# EAGLE schematic Saules kolektoriaus valdiklis v1.22 (EAGLE 6.5.0)
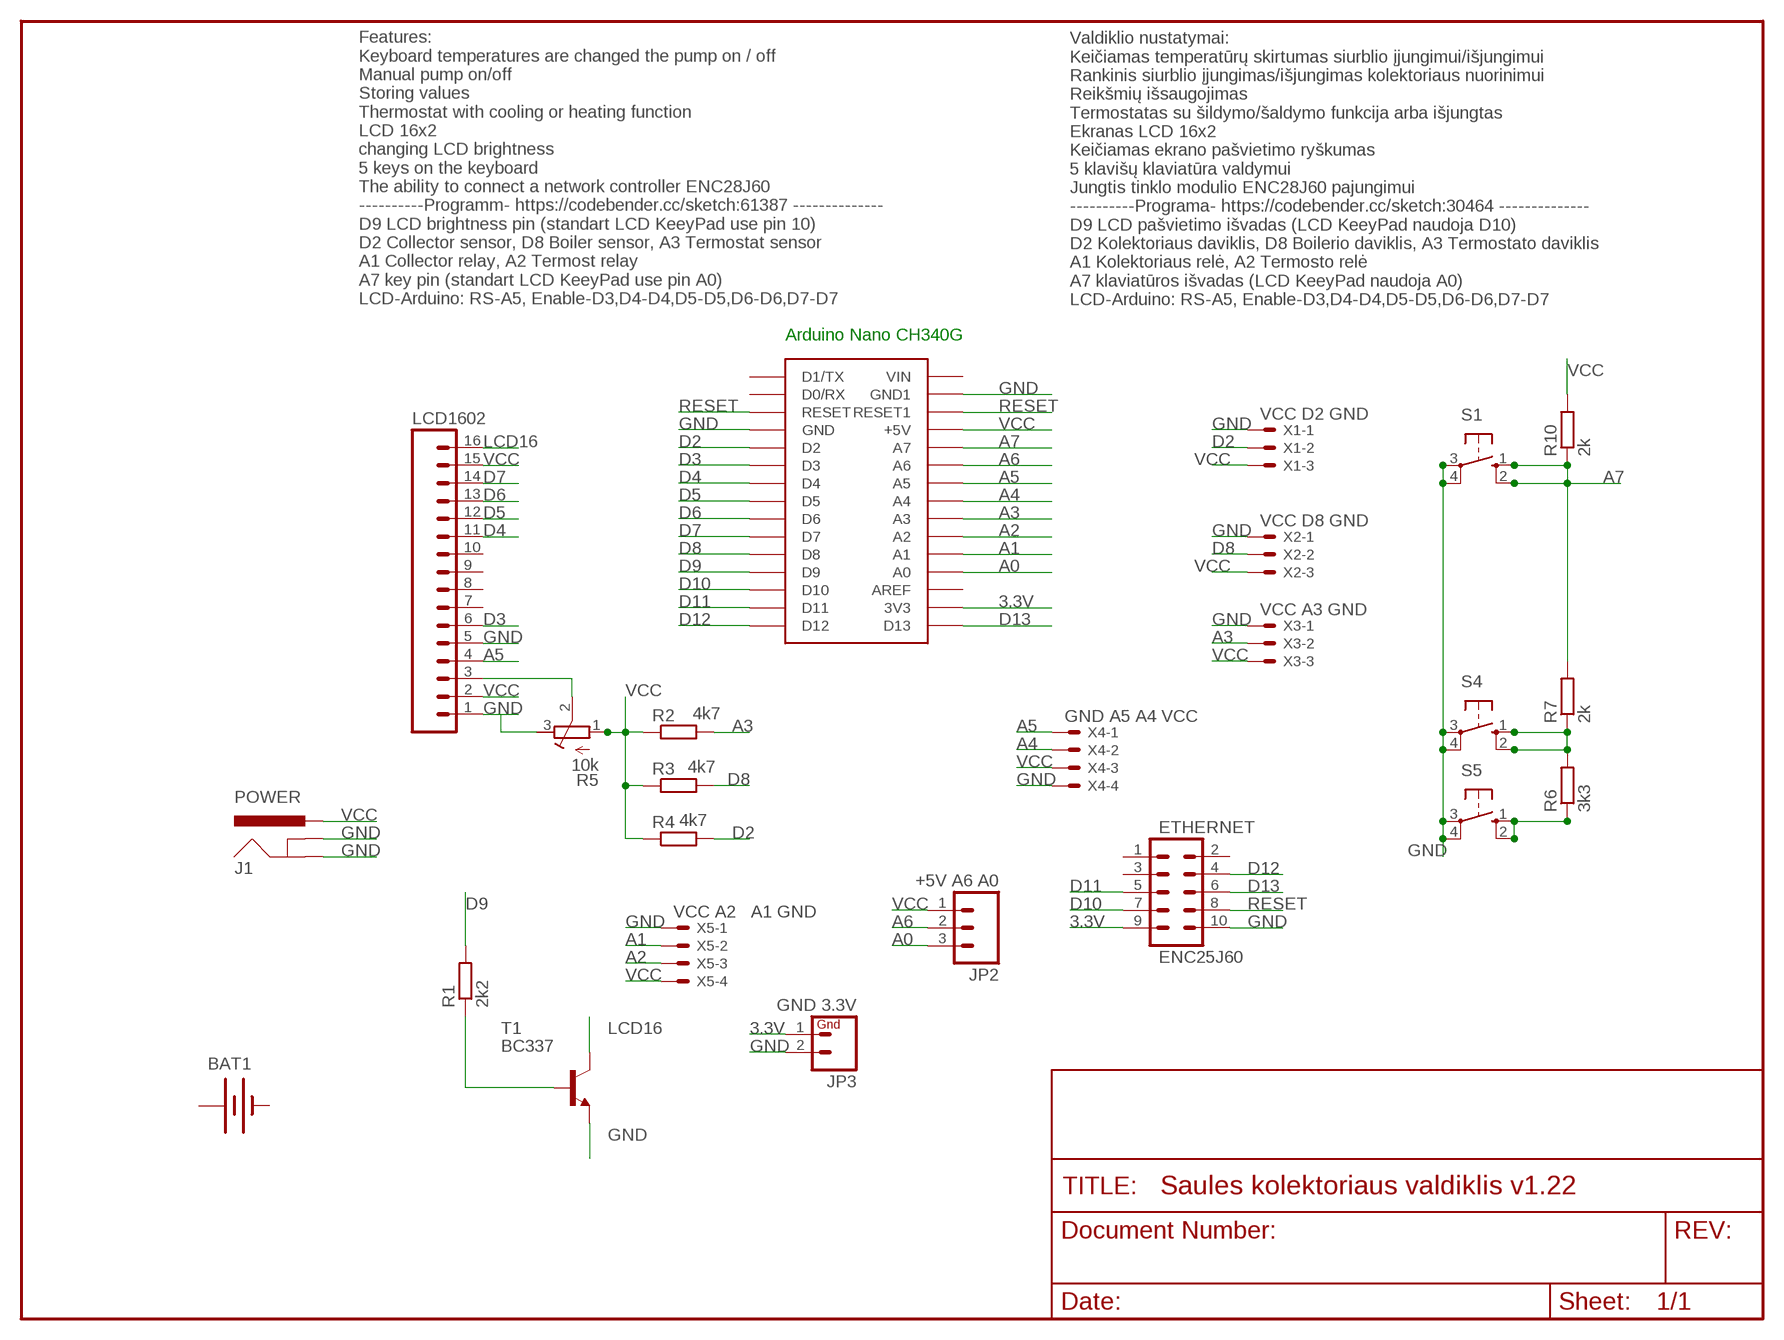
[diagram p0: schematic, sheet 1]

## Parts
ARDUINONANOCH340G  ARDUINONANO  [PDIP-32]
BAT1  BATTERY20PTH  [BATTCOM_20MM_PTH]
ETHERNET  ENC25J60  M05X2PTH  [AVR_ICSP]
J1  POWER  POWER_JACKPTH_LOCK  [POWER_JACK_PTH_LOCK]
JP2  +5V A6 A0  M03PTH  [1X03]
JP3  GND 3.3V  M02PTH  [1X02]
LCD1602  HEADER-16P-2.54  [16P-2.54]
R1  2k2  R-EU_0207/10  [0207/10]
R2  4k7  R-EU_0207/10  [0207/10]
R3  4k7  R-EU_0207/10  [0207/10]
R4  4k7  R-EU_0207/10  [0207/10]
R5  10k  R-TRIMM64W  [RTRIM64W]
R6  3k3  R-EU_0207/10  [0207/10]
R7  2k  R-EU_0207/10  [0207/10]
R10  2k  R-EU_0207/10  [0207/10]
S1  10-XX  [B3F-10XX]
S4  10-XX  [B3F-10XX]
S5  10-XX  [B3F-10XX]
T1  BC337  [TO92]
X1  VCC D2 GND  22-23-2031  [22-23-2031]
X2  VCC D8 GND  22-23-2031  [22-23-2031]
X3  VCC A3 GND  22-23-2031  [22-23-2031]
X4  GND A5 A4 VCC  22-23-2041  [22-23-2041]
X5  VCC A2 A1 GND  22-23-2041  [22-23-2041]

## Nets
3.3V: ARDUINONANOCH340G.3V3 ETHERNET.9 JP3.1
A0: ARDUINONANOCH340G.A0 JP2.3
A1: ARDUINONANOCH340G.A1 X5.2
A2: ARDUINONANOCH340G.A2 X5.3
A3: ARDUINONANOCH340G.A3 R2.2 X3.2
A4: ARDUINONANOCH340G.A4 X4.2
A5: ARDUINONANOCH340G.A5 LCD1602.4 X4.1
A6: ARDUINONANOCH340G.A6 JP2.2
A7: ARDUINONANOCH340G.A7 R7.2 R10.1 S1.1(S) S1.2(S1)
D2: ARDUINONANOCH340G.D2 R4.2 X1.2
D3: ARDUINONANOCH340G.D3 LCD1602.6
D4: ARDUINONANOCH340G.D4 LCD1602.11
D5: ARDUINONANOCH340G.D5 LCD1602.12
D6: ARDUINONANOCH340G.D6 LCD1602.13
D7: ARDUINONANOCH340G.D7 LCD1602.14
D8: ARDUINONANOCH340G.D8 R3.2 X2.2
D9: ARDUINONANOCH340G.D9 R1.2
D10: ARDUINONANOCH340G.D10 ETHERNET.7
D11: ARDUINONANOCH340G.D11 ETHERNET.5
D12: ARDUINONANOCH340G.D12 ETHERNET.4
D13: ARDUINONANOCH340G.D13 ETHERNET.6
GND [vcc]: ARDUINONANOCH340G.GND ARDUINONANOCH340G.GND1 ETHERNET.10 J1.GND J1.GNDBREAK JP3.2 LCD1602.1 LCD1602.5 R5.3(A) S1.3(P) S1.4(P1) S4.3(P) S4.4(P1) S5.3(P) S5.4(P1) T1.1(E) X1.1 X2.1 X3.1 X4.4 X5.1
LCD16: LCD1602.16 T1.3(C)
N$1: LCD1602.3 R5.2(S)
N$4: R1.1 T1.2(B)
N$5: R6.1 S5.1(S) S5.2(S1)
N$6: R6.2 R7.1 S4.1(S) S4.2(S1)
RESET: ARDUINONANOCH340G.RESET ARDUINONANOCH340G.RESET1 ETHERNET.8
VCC: ARDUINONANOCH340G.+5V J1.PWR JP2.1 LCD1602.2 LCD1602.15 R2.1 R3.1 R4.1 R5.1(E) R10.2 X1.3 X2.3 X3.3 X4.3 X5.4
Unconnected: ARDUINONANOCH340G.AREF ARDUINONANOCH340G.D0/RX ARDUINONANOCH340G.D1/TX ARDUINONANOCH340G.VIN ETHERNET.1 ETHERNET.2 ETHERNET.3 LCD1602.7 LCD1602.8 LCD1602.9 LCD1602.10

## Notes on the sheet
- Valdiklio nustatymai:
  Keičiamas temperatūrų skirtumas siurblio įjungimui/išjungimui
  Rankinis siurblio įjungimas/išjungimas kolektoriaus nuorinimui
  Reikšmių išsaugojimas
  Termostatas su šildymo/šaldymo funkcija arba išjungtas
  Ekranas LCD 16x2
  Keičiamas ekrano pašvietimo ryškumas
  5 klavišų klaviatūra valdymui
  Jungtis tinklo modulio ENC28J60 pajungimui
  ----------Programa- https://codebender.cc/sketch:30464 --------------
  D9 LCD pašvietimo išvadas (LCD KeeyPad naudoja D10)
  D2 Kolektoriaus daviklis, D8 Boilerio daviklis, A3 Termostato daviklis
  A1 Kolektoriaus relė, A2 Termosto relė
  A7 klaviatūros išvadas (LCD KeeyPad naudoja A0)
  LCD-Arduino: RS-A5, Enable-D3,D4-D4,D5-D5,D6-D6,D7-D7
- Features:
  Keyboard temperatures are changed the pump on / off
  Manual pump on/off
  Storing values
  Thermostat with cooling or heating function
  LCD 16x2
  changing LCD brightness
  5 keys on the keyboard
  The ability to connect a network controller ENC28J60
  ----------Programm- https://codebender.cc/sketch:61387 --------------
  D9 LCD brightness pin (standart LCD KeeyPad use pin 10)
  D2 Collector sensor, D8 Boiler sensor, A3 Termostat sensor
  A1 Collector relay, A2 Termost relay
  A7 key pin (standart LCD KeeyPad use pin A0)
  LCD-Arduino: RS-A5, Enable-D3,D4-D4,D5-D5,D6-D6,D7-D7
- Arduino Nano CH340G

## Power pins joined to a net without a drawn wire
+: BAT1.1(+)
-: BAT1.2(-)

## Library data of the parts
ARDUINONANOCH340G = rocketfarm:ARDUINONANO
BAT1 = SparkFun-Electromechanical:BATTERY: Battery Holders Various common sizes : AA, AAA, 20mm coin cell and 12mm coin cell. 20MM_4LEGS, BATT-10373
ETHERNET = SparkFun-Connectors:M05X2: Header 5x2 Standard 10-pin dual row 0.1" header. Commonly used with AVR-ISP. Use with Spark Fun Electronics SKU: PRT-00778
J1 = SparkFun-Connectors:POWER_JACK: Power Jack This is the standard 5.5mm barrel jack for power. The PTH is the most common, proven, reliable, footprint. The Slot footprint only works if the mill layer is transmitted to the PCB fab house so be warned. Spark Fun Electronics SKU : PRT-00119 SMT: CONN-08106 Mating wall wart : TOL-00298 (and others)
JP2 = SparkFun-Connectors:M03: Header 3 Standard 3-pin 0.1" header. Use with straight break away headers (SKU : PRT-00116), right angle break away headers (PRT-00553), swiss pins (PRT-00743), machine pins (PRT-00117), and female headers (PRT-00115). Molex polarized connector foot print use with SKU : PRT-08232 with associated crimp pins and housings.
JP3 = SparkFun:M02: Header 2 Standard 2-pin 0.1" header. Use with straight break away headers (SKU : PRT-00116), right angle break away headers (PRT-00553), swiss pins (PRT-00743), machine pins (PRT-00117), and female headers (PRT-00115). Molex polarized connector foot print use with SKU : PRT-08233 with associated crimp pins and housings.
LCD1602 = Connector_seedstudio:HEADER-16P
R1-R4 R6 R7 R10 = resistor:R-EU_: RESISTOR, European symbol
R5 = resistor:R-TRIMM: Trimm resistor
S1 S4 S5 = switch-omron:10-XX: OMRON SWITCH; MPN: B3F-1000; OC_FARNELL: 176432; OC_NEWARK: 36M3542
T1 = transistor:BC337: NPN TRANSISTOR
X1-X3 = con-molex:22-23-2031: .100" (2.54mm) Center Header - 3 Pin; MF: MOLEX; MPN: 22-23-2031; OC_FARNELL: 1462950; OC_NEWARK: 30C0862
X4 X5 = con-molex:22-23-2041: .100" (2.54mm) Center Header - 4 Pin; MF: MOLEX; MPN: 22-23-2041; OC_FARNELL: 1462920; OC_NEWARK: 38C0355

## Net classes
0 default: width 0.203 mm
1 vcc: width 0.254 mm